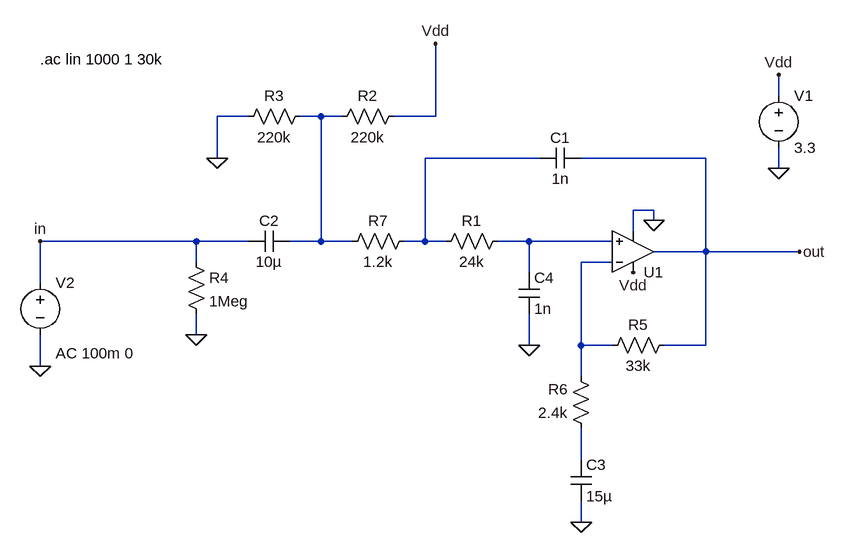
[diagram p0: schematic biased input amp with filter.asc]
biased input amp with filter.asc, the LTspice schematic file:
Version 4
SHEET 1 880 680
WIRE 336 -96 336 -128
WIRE -480 -64 -528 -64
WIRE -368 -64 -400 -64
WIRE -336 -64 -368 -64
WIRE -192 -64 -192 -176
WIRE -192 -64 -256 -64
WIRE -528 0 -528 -64
WIRE -32 0 -208 0
WIRE 224 0 32 0
WIRE 336 16 336 -16
WIRE 144 80 112 80
WIRE 144 96 144 80
WIRE 112 112 112 80
WIRE -560 128 -800 128
WIRE -480 128 -560 128
WIRE -368 128 -368 -64
WIRE -368 128 -416 128
WIRE -320 128 -368 128
WIRE -208 128 -208 0
WIRE -208 128 -240 128
WIRE -176 128 -208 128
WIRE -48 128 -96 128
WIRE 80 128 -48 128
WIRE 224 144 224 0
WIRE 224 144 144 144
WIRE 368 144 224 144
WIRE -560 160 -560 128
WIRE 80 160 32 160
WIRE -48 176 -48 128
WIRE -800 192 -800 128
WIRE -560 272 -560 240
WIRE -48 288 -48 240
WIRE 32 288 32 160
WIRE 80 288 32 288
WIRE 224 288 224 144
WIRE 224 288 160 288
WIRE -800 320 -800 272
WIRE 32 336 32 288
WIRE 32 464 32 416
WIRE 32 560 32 528
FLAG -528 0 0
FLAG -560 272 0
FLAG 336 16 0
FLAG 336 -128 Vdd
FLAG -192 -176 Vdd
FLAG 144 96 0
FLAG 112 176 Vdd
FLAG 368 144 out
FLAG 32 560 0
FLAG -800 320 0
FLAG -48 288 0
FLAG -800 128 in
SYMBOL Opamps\\UniversalOpamp2 112 144 M180
SYMATTR InstName U1
SYMBOL res -240 -80 R90
WINDOW 0 0 56 VBottom 2
WINDOW 3 32 56 VTop 2
SYMATTR InstName R2
SYMATTR Value 220k
SYMBOL res -384 -80 R90
WINDOW 0 0 56 VBottom 2
WINDOW 3 32 56 VTop 2
SYMATTR InstName R3
SYMATTR Value 220k
SYMBOL cap -416 112 R90
WINDOW 0 0 32 VBottom 2
WINDOW 3 32 32 VTop 2
SYMATTR InstName C2
SYMATTR Value 10µ
SYMBOL res -576 144 R0
SYMATTR InstName R4
SYMATTR Value 1Meg
SYMBOL voltage 336 -112 R0
WINDOW 123 0 0 Left 0
WINDOW 39 0 0 Left 0
SYMATTR InstName V1
SYMATTR Value 3.3
SYMBOL res 176 272 R90
WINDOW 0 0 56 VBottom 2
WINDOW 3 32 56 VTop 2
SYMATTR InstName R5
SYMATTR Value 33k
SYMBOL res 48 432 R180
WINDOW 0 36 76 Left 2
WINDOW 3 36 40 Left 2
SYMATTR InstName R6
SYMATTR Value 2.4k
SYMBOL cap 16 464 R0
SYMATTR InstName C3
SYMATTR Value 15µ
SYMBOL voltage -800 176 R0
WINDOW 123 24 124 Left 2
WINDOW 39 0 0 Left 0
SYMATTR Value2 AC 100m 0
SYMATTR InstName V2
SYMATTR Value ""
SYMBOL cap 32 -16 R90
WINDOW 0 0 32 VBottom 2
WINDOW 3 32 32 VTop 2
SYMATTR InstName C1
SYMATTR Value 1n
SYMBOL cap -64 176 R0
SYMATTR InstName C4
SYMATTR Value 1n
SYMBOL res -80 112 R90
WINDOW 0 0 56 VBottom 2
WINDOW 3 32 56 VTop 2
SYMATTR InstName R1
SYMATTR Value 24k
SYMBOL res -224 112 R90
WINDOW 0 0 56 VBottom 2
WINDOW 3 32 56 VTop 2
SYMATTR InstName R7
SYMATTR Value 1.2k
TEXT -800 -152 Left 2 !.ac lin 1000 1 30k

The netlist it stands for:
* biased input amp with filter.asc
XU1 N003 N004 Vdd 0 out level.2 Avol=1Meg GBW=10Meg Slew=10Meg ilimit=25m rail=0 Vos=0 phimargin=45 en=0 enk=0 in=0 ink=0 Rin=500Meg  ; pins IN+ IN- V+ V- OUT
R2 Vdd N001 220k
R3 N001 0 220k
C2 N001 in 10µ
R4 in 0 1Meg
V1 Vdd 0 3.3
R5 out N004 33k
R6 N005 N004 2.4k
C3 N005 0 15µ
V2 in 0 AC 100m 0
C1 out N002 1n
C4 N003 0 1n
R1 N003 N002 24k
R7 N002 N001 1.2k
.ac lin 1000 1 30k
.lib UniversalOpamps2.sub
.backanno
.end